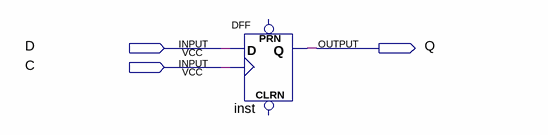
[diagram p0: schematic sheet]
// Quartus schematic lab4-1.bdf as structural Verilog: 1 symbols, 3 pins
module \lab4-1  (
  input  D,
  input  C,
  output Q
);

  DFF inst (.CLK(C), .D(D), .Q(Q));  // open: CLRN, PRN
endmodule
